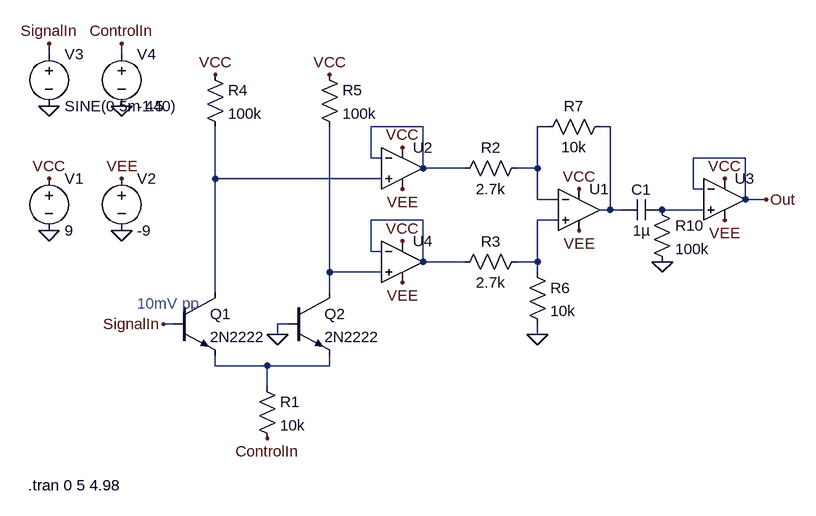
[diagram p0: schematic Amplifier.asc]
Amplifier.asc, the LTspice schematic file:
Version 4.1
SHEET 1 1356 1084
WIRE 0 256 0 240
WIRE 112 256 112 240
WIRE 576 368 496 368
WIRE 768 368 752 368
WIRE 864 368 848 368
WIRE 496 416 496 368
WIRE 512 416 496 416
WIRE 1072 416 992 416
WIRE 576 432 576 368
WIRE 640 432 576 432
WIRE 752 432 752 368
WIRE 752 432 720 432
WIRE 256 448 256 368
WIRE 512 448 256 448
WIRE 992 464 992 416
WIRE 1008 464 992 464
WIRE 752 480 752 432
WIRE 784 480 752 480
WIRE 1072 480 1072 416
WIRE 1104 480 1072 480
WIRE 864 496 864 368
WIRE 864 496 848 496
WIRE 880 496 864 496
WIRE 1008 496 944 496
WIRE 576 512 496 512
WIRE 784 512 752 512
WIRE 496 560 496 512
WIRE 512 560 496 560
WIRE 576 576 576 512
WIRE 640 576 576 576
WIRE 752 576 752 512
WIRE 752 576 720 576
WIRE 432 592 432 368
WIRE 512 592 432 592
WIRE 752 592 752 576
WIRE 256 624 256 448
WIRE 432 624 432 592
WIRE 192 672 176 672
WIRE 368 672 352 672
WIRE 352 688 352 672
WIRE 752 688 752 672
WIRE 256 736 256 720
WIRE 336 736 256 736
WIRE 432 736 432 720
WIRE 432 736 336 736
WIRE 336 768 336 736
FLAG 176 672 SignalIn
FLAG 336 848 ControlIn
FLAG 0 448 VCC
FLAG 112 448 VEE
FLAG 0 528 0
FLAG 112 528 0
FLAG 352 688 0
FLAG 256 288 VCC
FLAG 432 288 VCC
FLAG 752 688 0
FLAG 816 464 VCC
FLAG 816 528 VEE
FLAG 1104 480 Out
FLAG 944 576 0
FLAG 1040 448 VCC
FLAG 1040 512 VEE
FLAG 544 400 VCC
FLAG 544 464 VEE
FLAG 544 544 VCC
FLAG 544 608 VEE
FLAG 0 336 0
FLAG 0 240 SignalIn
FLAG 112 336 0
FLAG 112 240 ControlIn
SYMBOL voltage 0 432 R0
WINDOW 123 0 0 Left 0
WINDOW 39 0 0 Left 0
SYMATTR InstName V1
SYMATTR Value 9
SYMBOL voltage 112 432 R0
WINDOW 123 0 0 Left 0
WINDOW 39 0 0 Left 0
SYMATTR InstName V2
SYMATTR Value -9
SYMBOL npn 192 624 R0
SYMATTR InstName Q1
SYMATTR Value 2N2222
SYMBOL npn 368 624 R0
SYMATTR InstName Q2
SYMATTR Value 2N2222
SYMBOL res 320 752 R0
SYMATTR InstName R1
SYMATTR Value 10k
SYMBOL res 736 416 R90
WINDOW 0 0 56 VBottom 2
WINDOW 3 32 56 VTop 2
SYMATTR InstName R2
SYMATTR Value 2.7k
SYMBOL res 736 560 R90
WINDOW 0 0 56 VBottom 2
WINDOW 3 32 56 VTop 2
SYMATTR InstName R3
SYMATTR Value 2.7k
SYMBOL res 240 272 R0
SYMATTR InstName R4
SYMATTR Value 100k
SYMBOL res 416 272 R0
SYMATTR InstName R5
SYMATTR Value 100k
SYMBOL OpAmps\\UniversalOpAmp2 816 496 R0
SYMATTR InstName U1
SYMBOL res 736 576 R0
SYMATTR InstName R6
SYMATTR Value 10k
SYMBOL res 864 352 R90
WINDOW 0 0 56 VBottom 2
WINDOW 3 32 56 VTop 2
SYMATTR InstName R7
SYMATTR Value 10k
SYMBOL res 928 480 R0
SYMATTR InstName R10
SYMATTR Value 100k
SYMBOL OpAmps\\UniversalOpAmp2 1040 480 R0
SYMATTR InstName U3
SYMBOL cap 944 480 R90
WINDOW 0 0 32 VBottom 2
WINDOW 3 32 32 VTop 2
SYMATTR InstName C1
SYMATTR Value 1µ
SYMBOL OpAmps\\UniversalOpAmp2 544 432 R0
SYMATTR InstName U2
SYMBOL OpAmps\\UniversalOpAmp2 544 576 R0
SYMATTR InstName U4
SYMBOL voltage 112 240 R0
WINDOW 123 0 0 Left 0
WINDOW 39 0 0 Left 0
SYMATTR InstName V4
SYMATTR Value -1.5
SYMBOL voltage 0 240 R0
WINDOW 123 0 0 Left 0
WINDOW 39 0 0 Left 0
SYMATTR InstName V3
SYMATTR Value SINE(0 5m 440)
TEXT 136 640 Left 2 ;10mV pp
TEXT -32 920 Left 2 !.tran 0 5 4.98

The netlist it stands for:
* Amplifier.asc
V1 VCC 0 9
V2 VEE 0 -9
Q1 N004 SignalIn N009 0 2N2222
Q2 N008 0 N009 0 2N2222
R1 N009 ControlIn 10k
R2 N002 N001 2.7k
R3 N007 N006 2.7k
R4 VCC N004 100k
R5 VCC N008 100k
X§U1 N007 N002 VCC VEE N003 level2 Avol=1Meg GBW=10Meg Slew=10Meg Ilimit=25m Rail=0 Vos=0 En=0 Enk=0 In=0 Ink=0 Rin=500Meg  ; pins In+ In- V+ V- OUT
R6 N007 0 10k
R7 N003 N002 10k
R10 N005 0 100k
X§U3 N005 Out VCC VEE Out level2 Avol=1Meg GBW=10Meg Slew=10Meg Ilimit=25m Rail=0 Vos=0 En=0 Enk=0 In=0 Ink=0 Rin=500Meg  ; pins In+ In- V+ V- OUT
C1 N005 N003 1µ
X§U2 N004 N001 VCC VEE N001 level2 Avol=1Meg GBW=10Meg Slew=10Meg Ilimit=25m Rail=0 Vos=0 En=0 Enk=0 In=0 Ink=0 Rin=500Meg  ; pins In+ In- V+ V- OUT
X§U4 N008 N006 VCC VEE N006 level2 Avol=1Meg GBW=10Meg Slew=10Meg Ilimit=25m Rail=0 Vos=0 En=0 Enk=0 In=0 Ink=0 Rin=500Meg  ; pins In+ In- V+ V- OUT
V4 ControlIn 0 -1.5
V3 SignalIn 0 SINE(0 5m 440)
.model NPN NPN
.model PNP PNP
.lib standard.bjt
* 10mV pp
.tran 0 5 4.98
.lib UniversalOpAmp2.lib
.backanno
.end